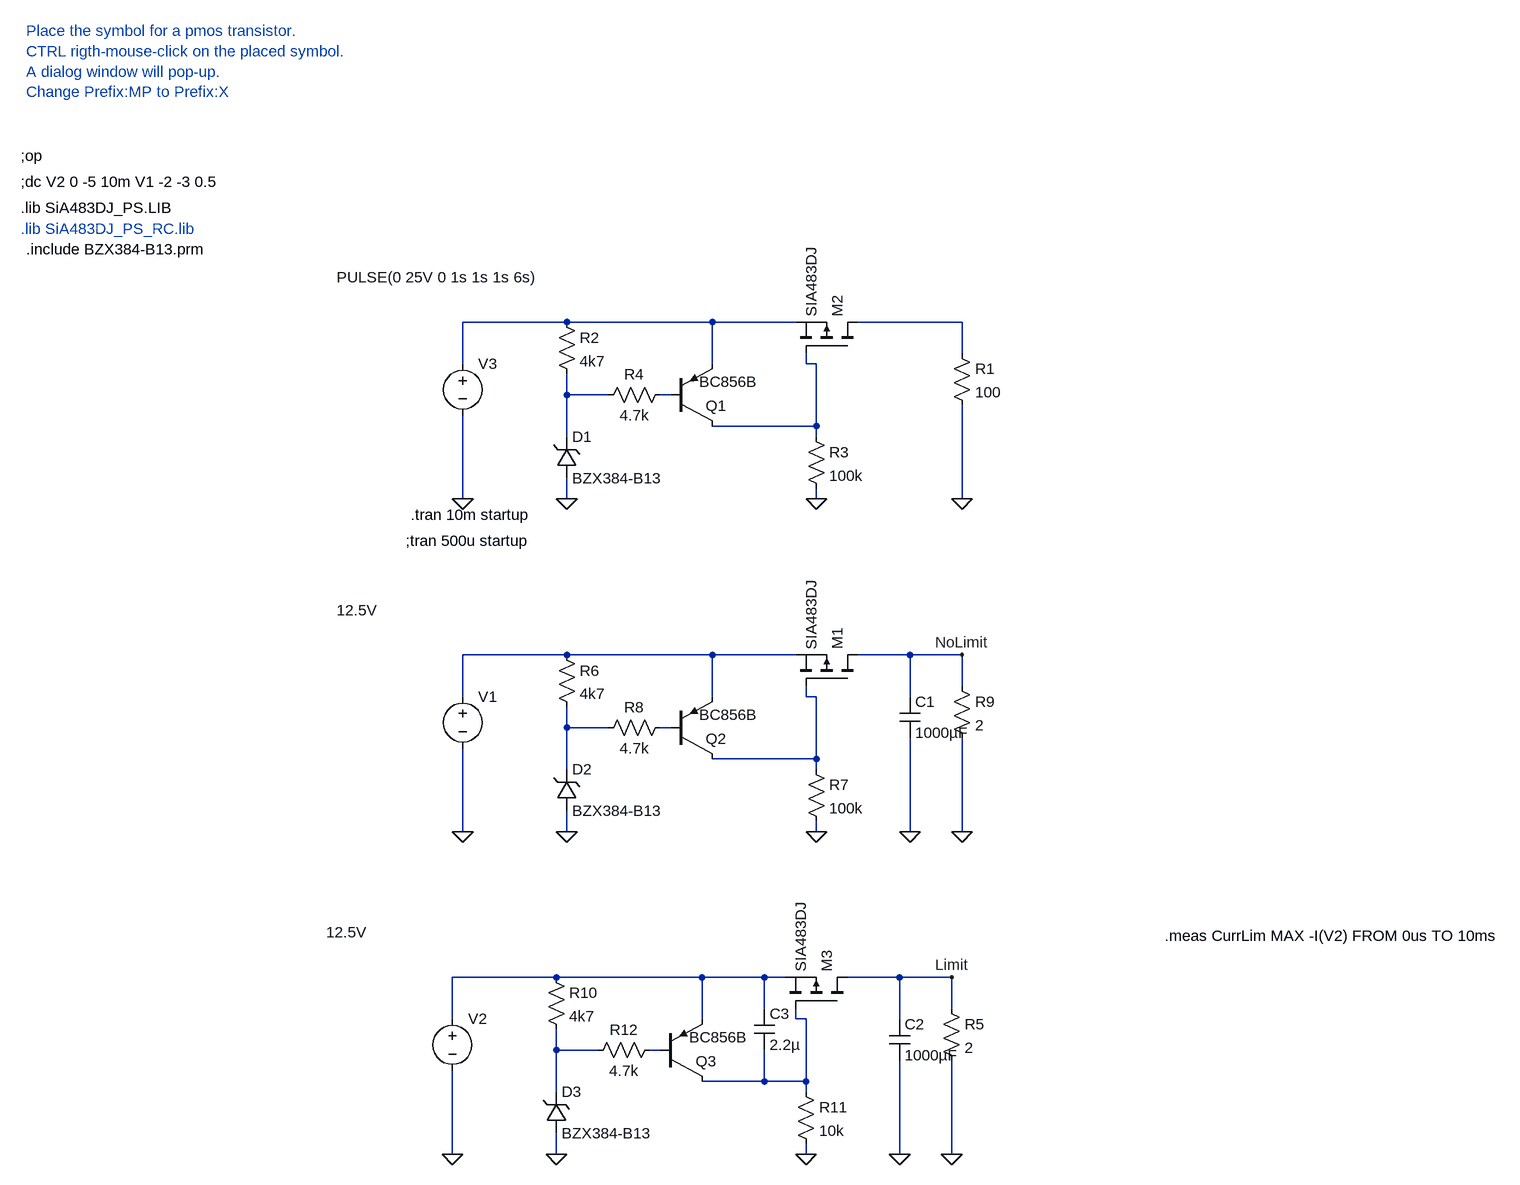
[diagram p0: schematic SIA483DJ_test.asc]
SIA483DJ_test.asc, the LTspice schematic file:
Version 4
SHEET 1 2400 1304
WIRE 896 -16 736 -16
WIRE 1120 -16 896 -16
WIRE 1248 -16 1120 -16
WIRE 1504 -16 1344 -16
WIRE 1504 32 1504 -16
WIRE 736 48 736 -16
WIRE 1120 48 1120 -16
WIRE 1264 48 1264 32
WIRE 1280 48 1264 48
WIRE 896 96 896 64
WIRE 960 96 896 96
WIRE 1056 96 1040 96
WIRE 1280 144 1280 48
WIRE 1280 144 1120 144
WIRE 896 160 896 96
WIRE 1280 160 1280 144
WIRE 736 256 736 128
WIRE 896 256 896 224
WIRE 1280 256 1280 240
WIRE 1504 256 1504 112
WIRE 896 496 736 496
WIRE 1120 496 896 496
WIRE 1248 496 1120 496
WIRE 1424 496 1344 496
WIRE 1504 496 1424 496
WIRE 1504 544 1504 496
WIRE 736 560 736 496
WIRE 1120 560 1120 496
WIRE 1264 560 1264 544
WIRE 1280 560 1264 560
WIRE 1424 560 1424 496
WIRE 896 608 896 576
WIRE 960 608 896 608
WIRE 1056 608 1040 608
WIRE 1280 656 1280 560
WIRE 1280 656 1120 656
WIRE 896 672 896 608
WIRE 1280 672 1280 656
WIRE 736 768 736 640
WIRE 896 768 896 736
WIRE 1280 768 1280 752
WIRE 1424 768 1424 624
WIRE 1504 768 1504 624
WIRE 880 992 720 992
WIRE 1104 992 880 992
WIRE 1200 992 1104 992
WIRE 1232 992 1200 992
WIRE 1408 992 1328 992
WIRE 1488 992 1408 992
WIRE 1200 1040 1200 992
WIRE 1488 1040 1488 992
WIRE 720 1056 720 992
WIRE 1104 1056 1104 992
WIRE 1248 1056 1248 1040
WIRE 1264 1056 1248 1056
WIRE 1408 1056 1408 992
WIRE 880 1104 880 1072
WIRE 944 1104 880 1104
WIRE 1040 1104 1024 1104
WIRE 1200 1152 1200 1104
WIRE 1200 1152 1104 1152
WIRE 1264 1152 1264 1056
WIRE 1264 1152 1200 1152
WIRE 880 1168 880 1104
WIRE 1264 1168 1264 1152
WIRE 720 1264 720 1136
WIRE 880 1264 880 1232
WIRE 1264 1264 1264 1248
WIRE 1408 1264 1408 1120
WIRE 1488 1264 1488 1120
FLAG 896 256 0
FLAG 736 256 0
FLAG 1280 256 0
FLAG 1504 256 0
FLAG 896 768 0
FLAG 736 768 0
FLAG 1280 768 0
FLAG 1504 768 0
FLAG 1424 768 0
FLAG 880 1264 0
FLAG 720 1264 0
FLAG 1264 1264 0
FLAG 1488 1264 0
FLAG 1408 1264 0
FLAG 1488 992 Limit
FLAG 1504 496 NoLimit
SYMBOL res 1488 16 R0
SYMATTR InstName R1
SYMATTR Value 100
SYMBOL zener 880 224 M180
WINDOW 0 24 64 Left 2
WINDOW 3 24 0 Left 2
SYMATTR InstName D1
SYMATTR Value BZX384-B13
SYMATTR Description Diode
SYMATTR Type diode
SYMBOL res 880 -32 R0
SYMATTR InstName R2
SYMATTR Value 4k7
SYMBOL voltage 736 32 R0
WINDOW 3 -194 -117 Left 2
WINDOW 123 0 0 Left 0
WINDOW 39 0 0 Left 0
SYMATTR Value PULSE(0 25V 0 1s 1s 1s 6s)
SYMATTR InstName V3
SYMBOL pnp 1056 144 M180
WINDOW 0 54 31 Left 2
WINDOW 3 44 68 Left 2
SYMATTR InstName Q1
SYMATTR Value BC856B
SYMBOL res 1264 144 R0
SYMATTR InstName R3
SYMATTR Value 100k
SYMBOL pmos 1344 32 M270
SYMATTR InstName M2
SYMATTR Value SIA483DJ
SYMATTR Prefix X
SYMBOL res 1056 80 R90
WINDOW 0 0 56 VBottom 2
WINDOW 3 32 56 VTop 2
SYMATTR InstName R4
SYMATTR Value 4.7k
SYMBOL zener 880 736 M180
WINDOW 0 24 64 Left 2
WINDOW 3 24 0 Left 2
SYMATTR InstName D2
SYMATTR Value BZX384-B13
SYMATTR Description Diode
SYMATTR Type diode
SYMBOL res 880 480 R0
SYMATTR InstName R6
SYMATTR Value 4k7
SYMBOL voltage 736 544 R0
WINDOW 3 -194 -117 Left 2
WINDOW 123 0 0 Left 0
WINDOW 39 0 0 Left 0
SYMATTR Value 12.5V
SYMATTR InstName V1
SYMBOL pnp 1056 656 M180
WINDOW 0 54 31 Left 2
WINDOW 3 44 68 Left 2
SYMATTR InstName Q2
SYMATTR Value BC856B
SYMBOL res 1264 656 R0
SYMATTR InstName R7
SYMATTR Value 100k
SYMBOL pmos 1344 544 M270
SYMATTR InstName M1
SYMATTR Value SIA483DJ
SYMATTR Prefix X
SYMBOL res 1056 592 R90
WINDOW 0 0 56 VBottom 2
WINDOW 3 32 56 VTop 2
SYMATTR InstName R8
SYMATTR Value 4.7k
SYMBOL cap 1408 560 R0
SYMATTR InstName C1
SYMATTR Value 1000µF
SYMBOL zener 864 1232 M180
WINDOW 0 24 64 Left 2
WINDOW 3 24 0 Left 2
SYMATTR InstName D3
SYMATTR Value BZX384-B13
SYMATTR Description Diode
SYMATTR Type diode
SYMBOL res 864 976 R0
SYMATTR InstName R10
SYMATTR Value 4k7
SYMBOL voltage 720 1040 R0
WINDOW 3 -194 -117 Left 2
WINDOW 123 0 0 Left 0
WINDOW 39 0 0 Left 0
SYMATTR Value 12.5V
SYMATTR InstName V2
SYMBOL pnp 1040 1152 M180
WINDOW 0 54 31 Left 2
WINDOW 3 44 68 Left 2
SYMATTR InstName Q3
SYMATTR Value BC856B
SYMBOL res 1248 1152 R0
SYMATTR InstName R11
SYMATTR Value 10k
SYMBOL pmos 1328 1040 M270
SYMATTR InstName M3
SYMATTR Value SIA483DJ
SYMATTR Prefix X
SYMBOL res 1040 1088 R90
WINDOW 0 0 56 VBottom 2
WINDOW 3 32 56 VTop 2
SYMATTR InstName R12
SYMATTR Value 4.7k
SYMBOL cap 1392 1056 R0
SYMATTR InstName C2
SYMATTR Value 1000µF
SYMBOL cap 1184 1040 R0
SYMATTR InstName C3
SYMATTR Value 2.2µ
SYMBOL res 1472 1024 R0
SYMATTR InstName R5
SYMATTR Value 2
SYMBOL res 1488 528 R0
SYMATTR InstName R9
SYMATTR Value 2
TEXT 56 -232 Left 2 !;dc V2 0 -5 10m V1 -2 -3 0.5
TEXT 56 -192 Left 2 !.lib SiA483DJ_PS.LIB
TEXT 56 -160 Left 2 ;.lib SiA483DJ_PS_RC.lib
TEXT 56 -272 Left 2 !;op
TEXT 64 -464 Left 2 ;Place the symbol for a pmos transistor.\nCTRL rigth-mouse-click on the placed symbol.\nA dialog window will pop-up.\nChange Prefix:MP to Prefix:X
TEXT 656 280 Left 2 !.tran 10m startup
TEXT 64 -128 Left 2 !.include BZX384-B13.prm
TEXT 648 320 Left 2 !;tran 500u startup
TEXT 1816 928 Left 2 !.meas CurrLim MAX -I(V2) FROM 0us TO 10ms

The netlist it stands for:
* SIA483DJ_test.asc
R1 N002 0 100
D1 0 N004 BZX384-B13
R2 N001 N004 4k7
V3 N001 0 PULSE(0 25V 0 1s 1s 1s 6s)
Q1 N003 N005 N001 0 BC856B
R3 N003 0 100k
XM2 N002 N003 N001 SIA483DJ  ; pins D G S
R4 N005 N004 4.7k
D2 0 N008 BZX384-B13
R6 N006 N008 4k7
V1 N006 0 12.5V
Q2 N007 N009 N006 0 BC856B
R7 N007 0 100k
XM1 NoLimit N007 N006 SIA483DJ  ; pins D G S
R8 N009 N008 4.7k
C1 NoLimit 0 1000µF
D3 0 N012 BZX384-B13
R10 N010 N012 4k7
V2 N010 0 12.5V
Q3 N011 N013 N010 0 BC856B
R11 N011 0 10k
XM3 Limit N011 N010 SIA483DJ  ; pins D G S
R12 N013 N012 4.7k
C2 Limit 0 1000µF
C3 N010 N011 2.2µ
R5 Limit 0 2
R9 NoLimit 0 2
.model D D
.lib standard.dio
.model NPN NPN
.model PNP PNP
.lib standard.bjt
;dc V2 0 -5 10m V1 -2 -3 0.5
.lib SiA483DJ_PS.LIB
* .lib SiA483DJ_PS_RC.lib
;op
* Place the symbol for a pmos transistor.
* CTRL rigth-mouse-click on the placed symbol.
* A dialog window will pop-up.
* Change Prefix:MP to Prefix:X
.tran 10m startup
.include BZX384-B13.prm
;tran 500u startup
.meas CurrLim MAX -I(V2) FROM 0us TO 10ms
.backanno
.end

* Results of the author's LTspice run, read from the files saved beside the schematic
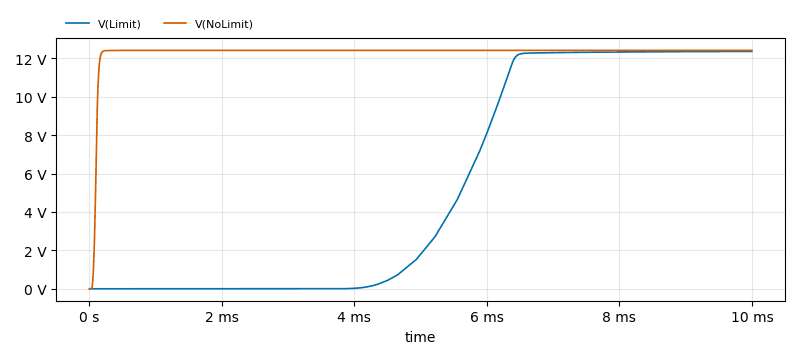
[diagram p1: Transient Analysis of SIA483DJ_test.asc, plotted from the saved traces]
* Transient Analysis, 1 run:
*   V(Limit): min 0 V, max 12.36 V, average 5.349 V, rms 7.823 V, last 12.36 V
*   V(NoLimit): min 0 V, max 12.41 V, average 12.29 V, rms 12.34 V, last 12.41 V
* From the log:
*   currlim: MAX(-i(v2))=15.8035 FROM 0 TO 0.01